# Altium project Prakticna_projekat.PrjPcb
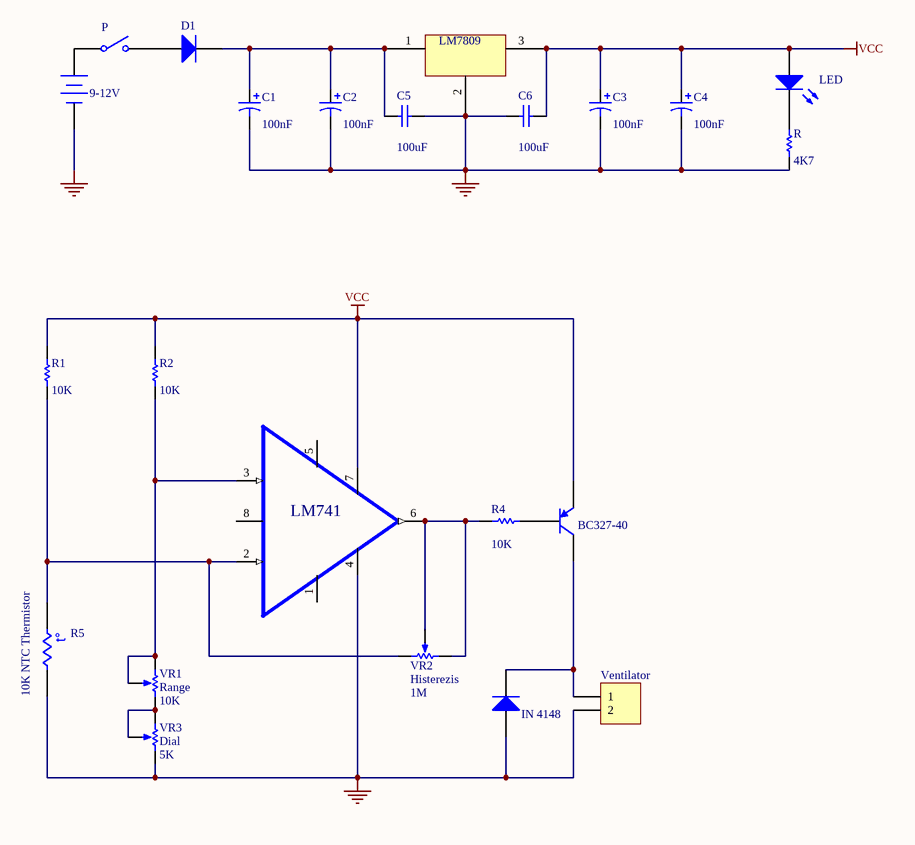
[diagram p0: Sema.SchDoc]
1 sheet, 23 parts. Net scope: global (net labels, ports and power ports of the same name join across sheets).
Board file: PCB1.PcbDoc

## Sheet Sema.SchDoc: Termostat sa histerezisom
size A; DrawnBy: Srđan Beška; Revision: v1.0; SheetNumber: 1; SheetTotal: 1; ProjectName: Termostat sa histerezisom

### Parts
9V  9-12V  [BAT-2]
C1  value 100nF  [CAPPRD350W60D800H1150]  (hidden comment: Cap Pol1)
C2  value 100nF  [CAPPRD350W60D800H1150]  (hidden comment: Cap Pol1)
C3  value 100nF  [CAPPRD350W60D800H1150]  (hidden comment: Cap Pol1)
C4  value 100nF  [CAPPRD350W60D800H1150]  (hidden comment: Cap Pol1)
C5  value 100uF  [RAD-0.1-2]  (hidden comment: Cap)
C6  value 100uF  [RAD-0.1-2]  (hidden comment: Cap)
D1  Diode  [DIOAD1300W80L670D310]  (value not drawn)
D2  IN 4148  [DIOAD1300W80L670D310]
LED  LED  [LED-2]  (value not drawn)
LM741  LM741  [DIP254P762X508-8]
LM7809  LM7809  [TO254P1054X470X2600-3]
P  SW-SPST  [SPST-2]  (value not drawn)
R  value 4K7  [axial-0.4]  (hidden comment: Res1)
R1  value 10K  [axial-0.4]  (hidden comment: Res1)
R2  value 10K  [axial-0.4]  (hidden comment: Res1)
R4  value 10K  [axial-0.4]  (hidden comment: Res1)
R5  10K NTC Thermistor  [RAD-0.1]
Tr  BC327-40  [TO-92A]
Ventilator  Ventilator  [BAT-2]  (value not drawn)
VR1  Range  value 10K  [VR5]
VR2  Histerezis  value 1M  [VR5]
VR3  Dial  value 5K  [VR5]

### Nets
GND: 9V.2(-) C1.2 C2.2 C3.2 C4.2 C5.2 C6.1 D2.1(A) LM741.4(V-) LM7809.2(GND) R.1 R5.2 Ventilator.2 VR3.3(BOT)
VCC: C3.1 C4.1 C6.2 LED.1(A) LM741.7(V+) LM7809.3(POS) R1.2 R2.2 Tr.3(E)
Net9V_1: 9V.1(+) P.1(COMMON)
NetC1_1: C1.1 C2.1 C5.1 D1.2(K) LM7809.1(OF2)
NetD1_1: D1.1(A) P.2(NO)
NetD2_2: D2.2(K) Tr.1(C) Ventilator.1
NetLED_2: LED.2(K) R.2
NetLM741_2: LM741.2(NEG) R1.1 R5.1 VR2.3(BOT)
NetLM741_3: LM741.3(POS) R2.1 VR1.1(TOP) VR1.2(TAP)
NetLM741_6: LM741.6(OUT) R4.2 VR2.1(TOP) VR2.2(TAP)
NetR4_1: R4.1 Tr.2(B)
NetVR1_3: VR1.3(BOT) VR3.1(TOP) VR3.2(TAP)

Not connected (* = marked no-connect by the designer): LM741 1(OF2) 5(OF1) 8(NC)

### Notes on the sheet
- (in symbol Res Thermal) t°

### Library data of the parts
9V = Battery: Multicell Battery; Published: 24-Mar-1999; LatestRevisionDate: 17-Jul-2002; LatestRevisionNote: Re-released for DXP Platform.; PackageReference: BAT-2; Publisher: Altium Limited; PackageDescription: Battery; 2 Leads
C1-C4 = Cap Pol1: Polarized Capacitor (Radial); Published: 8-Jun-2000; LatestRevisionDate: 17-Jul-2002; LatestRevisionNote: Re-released for DXP Platform.; PackageReference: RB7.6-15; Publisher: Altium Limited; PackageDescription: Polarized Capacitor (Radial); 2 Leads
C5 C6 = Cap: Capacitor; Published: 8-Jun-2000; LatestRevisionDate: 17-Jul-2002; LatestRevisionNote: Re-released for DXP Platform.; PackageReference: RAD-0.3; Publisher: Altium Limited; PackageDescription: Radial Cap, Thru-Hole; 2 Leads; 0.3 in Pin Spacing
D1 D2 = Diode: Default Diode; Published: 8-Jun-2000; LatestRevisionDate: 17-Jul-2002; LatestRevisionNote: Re-released for DXP Platform.; PackageVersion: Sep-1996; PackageReference: SMC; Publisher: Altium Limited; PackageDescription: DO-214-AB/SMC; 2 C-Bend Leads; Body 7.9 x 5.9 mm, inc. leads (LxW); Code_JEDEC: DO-214-AB
LED = LED1: Typical RED GaAs LED; Published: 8-Jun-2000; LatestRevisionDate: 08-Jul-2005; LatestRevisionNote: Mech Layer 1 removed.; PackageReference: LED-1; Publisher: Altium Limited; PackageDescription: LED; 2 Leads
LM741 = LM741CN: General Purpose Amplifier 1 Circuit 8-DIP; MF: ON Semiconductor; MP: LM741CN; Availability: In Stock; SnapEDA_Link: https://www.snapeda.com/parts/LM741CN/ON%20Semiconductor/view-part/4797666/?ref=snap; Value: *; Check_prices: https://www.snapeda.com/parts/LM741CN/ON%20Semiconductor/view-part/4797666/?ref=eda; Package: DIP-8 ON Semiconductor; Price: None
LM7809 = Component_1
P = SW-SPST: Single-Pole, Single-Throw Switch; Published: 24-Mar-1999; LatestRevisionDate: 17-Jul-2002; LatestRevisionNote: Re-released for DXP Platform.; PackageReference: SPST-2; Publisher: Altium Limited; PackageDescription: Switch; 2 Leads
R R1 R2 R4 = Res1: Resistor; Published: 8-Jun-2000; LatestRevisionDate: 17-Jul-2002; LatestRevisionNote: Re-released for DXP Platform.; PackageReference: AXIAL-0.3; Publisher: Altium Limited; PackageDescription: Axial Device, Thru-Hole; 2 Leads; 0.3 in Pin Spacing
R5 = Res Thermal: Thermistor; Published: 24-Mar-1999; LatestRevisionDate: 29-May-2009; LatestRevisionNote: IPC-7351 Footprint Added.; PackageVersion: Mar-2003; PackageReference: 6-0805; Publisher: Altium Limited; PackageDescription: Chip Resistor 0805 Case Size; Code_IPC: RESC2012
Tr = 2N3906: PNP General Purpose Amplifier; Published: 8-Jun-2000; LatestRevisionDate: 15-Jan-2003; LatestRevisionNote: PCB Footprint 'BCY-W3/D4.7' replaced; DatasheetVersion: 1997; PackageVersion: Sep-1998; PackageReference: TO-92A; Publisher: Altium Limited; PackageDescription: TO, Flat Index; 3 In-Line, Axial Leads; Body Dia. 4.5mm; Leads 0.51 x 0.48 mm (max); ComponentLink1Description: Manufacturer Link; ComponentLink1URL: http://www.fairchildsemi.com/; ComponentLink2Description: Datasheet; ComponentLink2URL: http://www.fairchildsemi.com/ds/2N%2F2N3906.pdf
Ventilator = Header 2: Header, 2-Pin; LatestRevisionDate: 17-Jul-2002; LatestRevisionNote: Re-released for DXP Platform.; Publisher: Altium Limited
VR1-VR3 = RPot: Potentiometer; Sim Note: Enter the Resistance value and the set point into parameter fields.; Set Position: 0.5; Published: 8-Jun-2000; LatestRevisionDate: 17-Jul-2002; LatestRevisionNote: Re-released for DXP Platform.; PackageReference: VR5; Publisher: Altium Limited; PackageDescription: Variable Resistor, Thru-Hole; 3 Leads